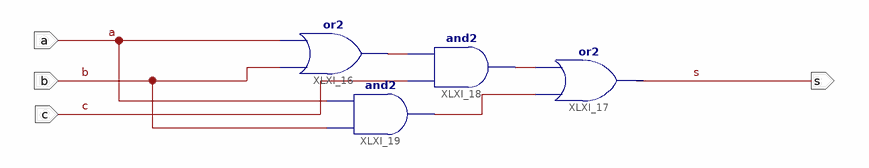
[diagram p0: schematic sheet 1]
// Xilinx ISE schematic circuit3.sch (spartan3e) as structural Verilog: 4 symbols, 4 ports
module circuit3 (
  input  a,
  input  c,
  input  b,
  output s
);

  wire XLXN_22, XLXN_23, XLXN_24;

  or XLXI_16 (XLXN_22, b, a);
  or XLXI_17 (s, XLXN_24, XLXN_23);
  and XLXI_18 (XLXN_23, c, XLXN_22);
  and XLXI_19 (XLXN_24, b, a);
endmodule
